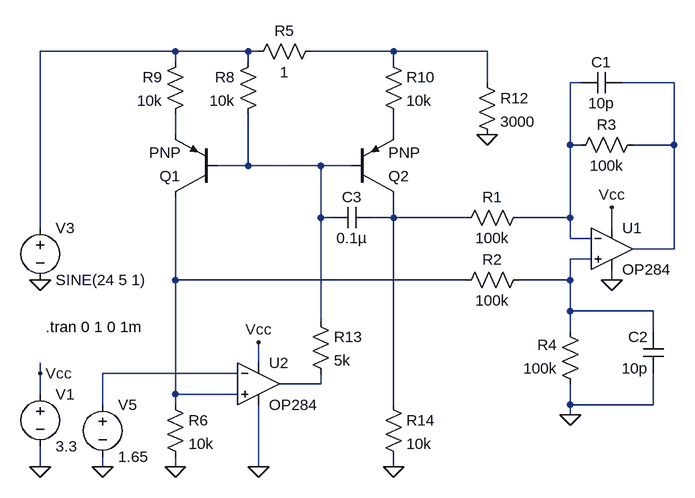
[diagram p0: schematic Diff_OAMP_0.asc]
Diff_OAMP_0.asc, the LTspice schematic file:
Version 4
SHEET 1 1116 964
WIRE -368 -176 -576 -176
WIRE -256 -176 -368 -176
WIRE -240 -176 -256 -176
WIRE -32 -176 -160 -176
WIRE 112 -176 -32 -176
WIRE -368 -160 -368 -176
WIRE -256 -160 -256 -176
WIRE -32 -160 -32 -176
WIRE 112 -128 112 -176
WIRE 256 -128 240 -128
WIRE 400 -128 320 -128
WIRE -368 -48 -368 -80
WIRE -32 -48 -32 -80
WIRE 240 -32 240 -128
WIRE 256 -32 240 -32
WIRE 400 -32 400 -128
WIRE 400 -32 336 -32
WIRE -256 0 -256 -80
WIRE -256 0 -304 0
WIRE -144 0 -256 0
WIRE -96 0 -144 0
WIRE -144 80 -144 0
WIRE -128 80 -144 80
WIRE -32 80 -32 48
WIRE -32 80 -64 80
WIRE 80 80 -32 80
WIRE 240 80 240 -32
WIRE 240 80 160 80
WIRE -576 96 -576 -176
WIRE 304 96 304 64
WIRE 240 112 240 80
WIRE 272 112 240 112
WIRE 400 128 400 -32
WIRE 400 128 336 128
WIRE 272 144 240 144
WIRE -368 176 -368 48
WIRE 80 176 -368 176
WIRE 240 176 240 144
WIRE 240 176 160 176
WIRE 304 176 304 160
WIRE 240 224 240 176
WIRE 368 224 240 224
WIRE -144 240 -144 80
WIRE 240 256 240 224
WIRE 368 256 368 224
WIRE -240 304 -240 272
WIRE -576 320 -576 304
WIRE -272 320 -480 320
WIRE -144 336 -144 320
WIRE -144 336 -208 336
WIRE -576 352 -576 320
WIRE -368 352 -368 176
WIRE -272 352 -368 352
WIRE -480 368 -480 320
WIRE -368 368 -368 352
WIRE -32 368 -32 80
WIRE 240 368 240 336
WIRE 368 368 368 320
WIRE 368 368 240 368
WIRE 240 384 240 368
WIRE -576 464 -576 432
WIRE -480 464 -480 448
WIRE -368 464 -368 448
WIRE -240 464 -240 368
WIRE -32 464 -32 448
FLAG 304 64 Vcc
FLAG -576 464 0
FLAG -576 320 Vcc
FLAG 112 -48 0
FLAG -576 176 0
FLAG 304 176 0
FLAG -480 464 0
FLAG -240 272 Vcc
FLAG -240 464 0
FLAG -368 464 0
FLAG 240 384 0
FLAG -32 464 0
SYMBOL Opamps\\OP284 304 64 R0
SYMATTR InstName U1
SYMBOL res 176 64 R90
WINDOW 0 0 56 VBottom 2
WINDOW 3 32 56 VTop 2
SYMATTR InstName R1
SYMATTR Value 100k
SYMBOL res 176 160 R90
WINDOW 0 0 56 VBottom 2
WINDOW 3 32 56 VTop 2
SYMATTR InstName R2
SYMATTR Value 100k
SYMBOL res 352 -48 R90
WINDOW 0 0 56 VBottom 2
WINDOW 3 32 56 VTop 2
SYMATTR InstName R3
SYMATTR Value 100k
SYMBOL res 256 352 R180
WINDOW 0 36 76 Left 2
WINDOW 3 36 40 Left 2
SYMATTR InstName R4
SYMATTR Value 100k
SYMBOL voltage -576 336 R0
WINDOW 123 0 0 Left 0
WINDOW 39 0 0 Left 0
SYMATTR InstName V1
SYMATTR Value 3.3
SYMBOL res -144 -192 R90
WINDOW 0 0 56 VBottom 2
WINDOW 3 32 56 VTop 2
SYMATTR InstName R5
SYMATTR Value 1
SYMBOL cap 320 -144 R90
WINDOW 0 0 32 VBottom 2
WINDOW 3 32 32 VTop 2
SYMATTR InstName C1
SYMATTR Value 10p
SYMBOL cap 384 320 R180
WINDOW 0 24 56 Left 2
WINDOW 3 24 8 Left 2
SYMATTR InstName C2
SYMATTR Value 10p
SYMBOL res 96 -144 R0
SYMATTR InstName R12
SYMATTR Value 3000
SYMBOL voltage -576 80 R0
WINDOW 123 0 0 Left 0
WINDOW 39 0 0 Left 0
SYMATTR InstName V3
SYMATTR Value SINE(24 5 1)
SYMBOL voltage -480 352 R0
WINDOW 123 0 0 Left 0
WINDOW 39 0 0 Left 0
SYMATTR InstName V5
SYMATTR Value 1.65
SYMBOL Opamps\\OP284 -240 272 R0
SYMATTR InstName U2
SYMBOL res -384 352 R0
SYMATTR InstName R6
SYMATTR Value 10k
SYMBOL res -160 224 R0
SYMATTR InstName R13
SYMATTR Value 5k
SYMBOL pnp -304 48 R180
SYMATTR InstName Q1
SYMBOL pnp -96 48 M180
SYMATTR InstName Q2
SYMBOL res -240 -176 M0
SYMATTR InstName R8
SYMATTR Value 10k
SYMBOL res -352 -176 M0
SYMATTR InstName R9
SYMATTR Value 10k
SYMBOL res -48 -176 R0
SYMATTR InstName R10
SYMATTR Value 10k
SYMBOL res -48 352 R0
SYMATTR InstName R14
SYMATTR Value 10k
SYMBOL cap -128 96 R270
WINDOW 0 32 32 VTop 2
WINDOW 3 0 32 VBottom 2
SYMATTR InstName C3
SYMATTR Value 0.1µ
TEXT -568 248 Left 2 !.tran 0 1 0 1m

The netlist it stands for:
* Diff_OAMP_0.asc
XU1 N009 N003 Vcc 0 N004 OP284  ; pins In+ In- V+ V- OUT
R1 N003 N008 100k
R2 N009 N010 100k
R3 N004 N003 100k
R4 0 N009 100k
V1 Vcc 0 3.3
R5 N002 N001 1
C1 N004 N003 10p
C2 0 N009 10p
R12 N002 0 3000
V3 N001 0 SINE(24 5 1)
V5 N011 0 1.65
XU2 N010 N011 Vcc 0 N012 OP284  ; pins In+ In- V+ V- OUT
R6 N010 0 10k
R13 N007 N012 5k
Q1 N010 N007 N005 0 PNP
Q2 N008 N007 N006 0 PNP
R8 N001 N007 10k
R9 N001 N005 10k
R10 N002 N006 10k
R14 N008 0 10k
C3 N007 N008 0.1µ
.model NPN NPN
.model PNP PNP
.lib standard.bjt
.tran 0 1 0 1m
.lib ADI1.lib
.backanno
.end